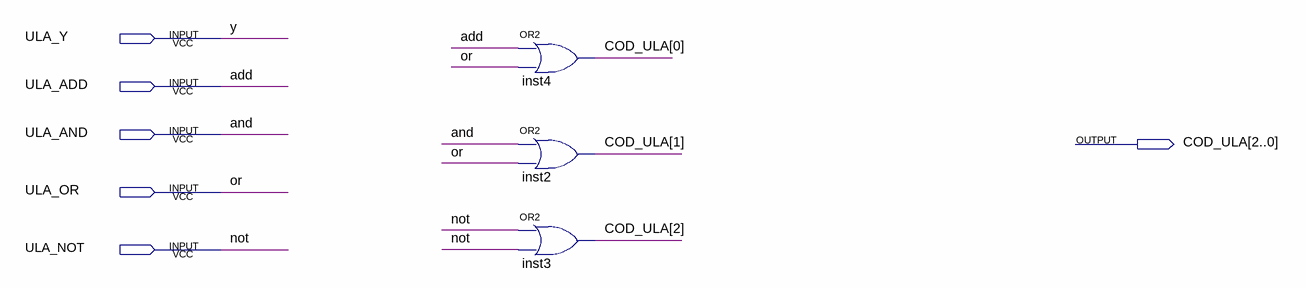
[diagram p0: schematic sheet]
// Quartus schematic CODIFICADOR_ULA.bdf as structural Verilog: 3 symbols, 6 pins
module CODIFICADOR_ULA (
  input  ULA_Y,
  input  ULA_ADD,
  input  ULA_AND,
  input  ULA_OR,
  input  ULA_NOT,
  output [2:0] COD_ULA
);

  or inst4 (COD_ULA[0], ULA_ADD, ULA_OR);
  or inst2 (COD_ULA[1], ULA_AND, ULA_OR);
  or inst3 (COD_ULA[2], ULA_NOT, ULA_NOT);

  // Other names for the same wires on the sheet: add = ULA_ADD; and = ULA_AND; not = ULA_NOT; or = ULA_OR; y = ULA_Y
endmodule
